# EAGLE design SpiderFab (EAGLE 9.5.1)
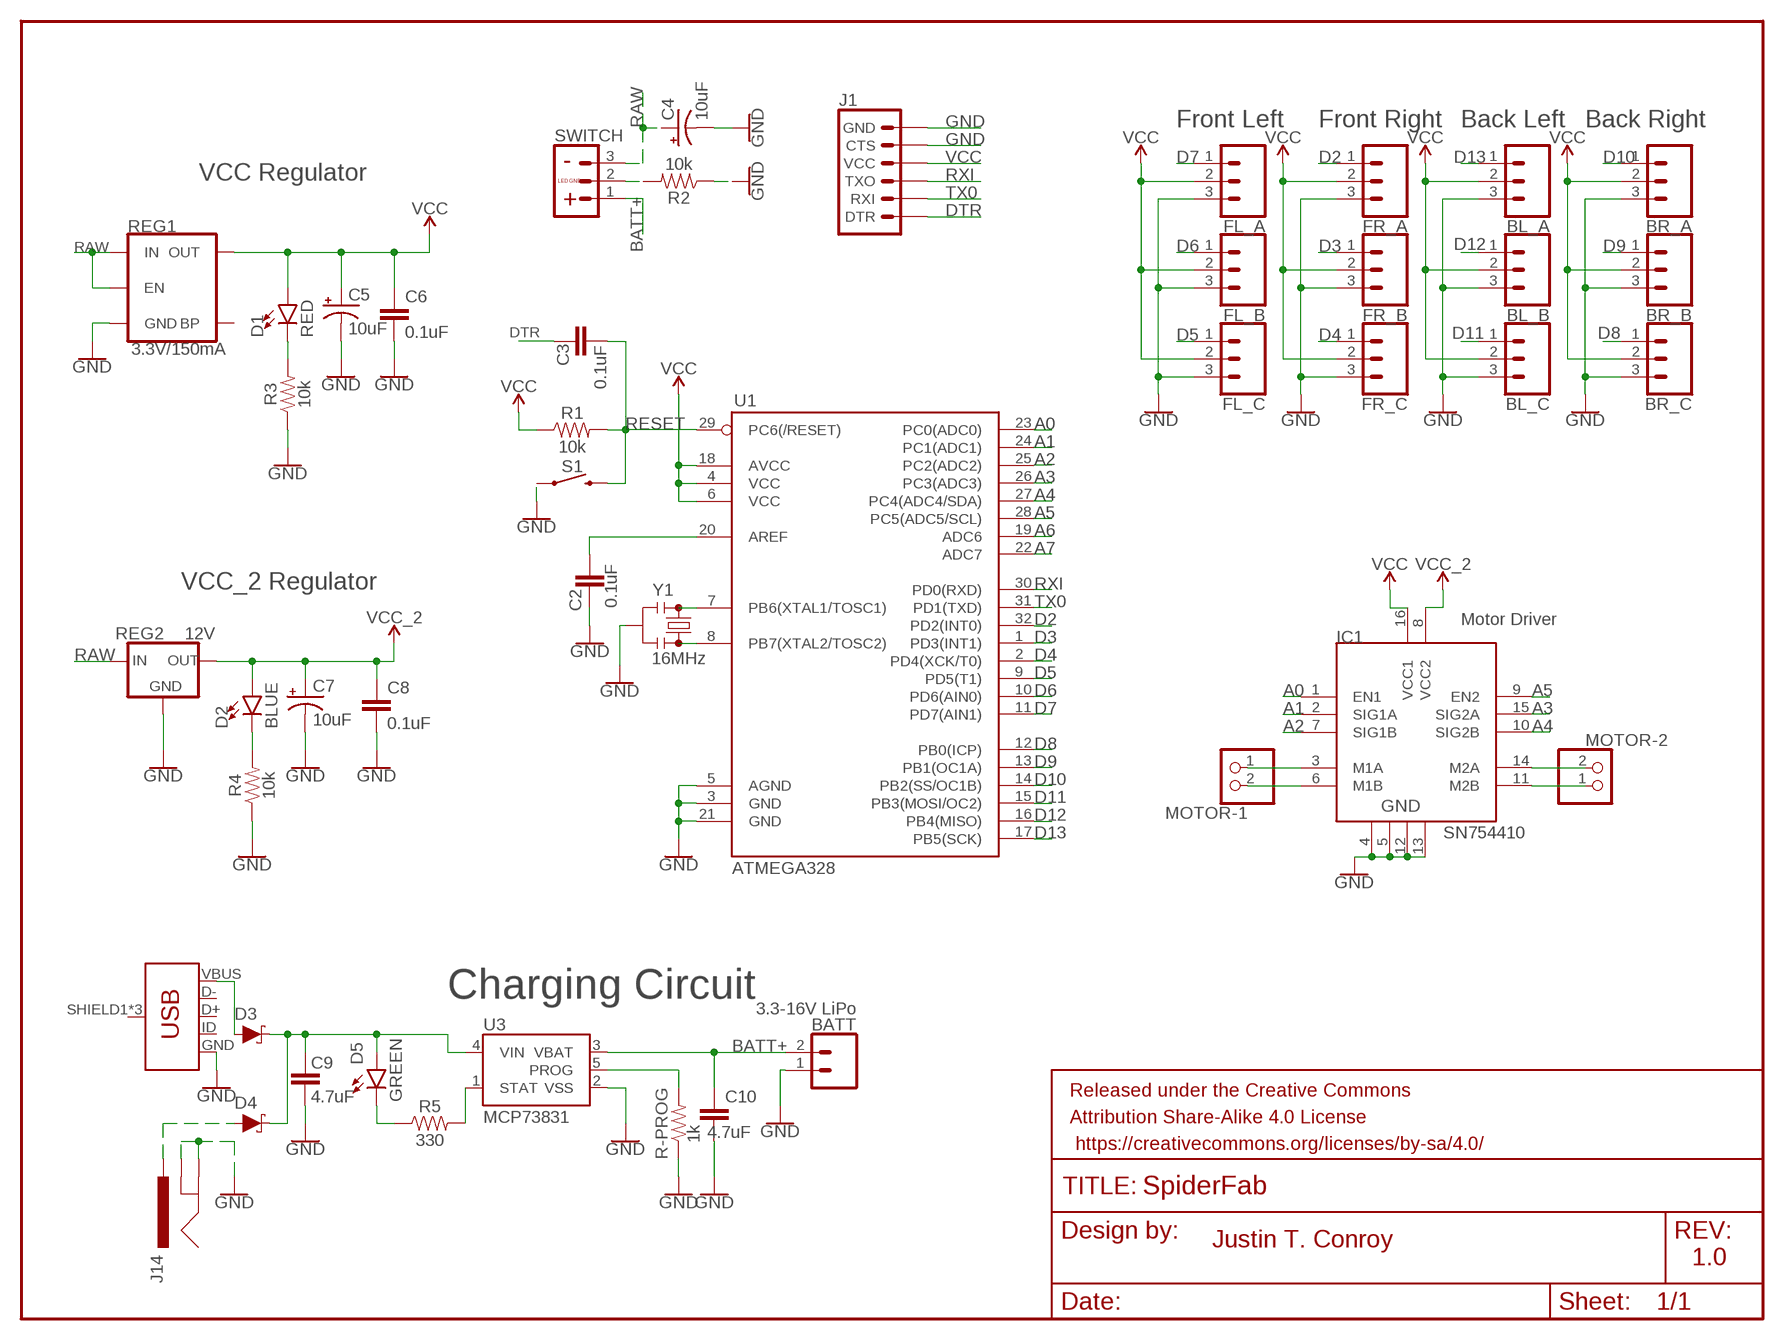
[diagram p0: schematic, sheet 1]

## Parts
BATT  3.3-16V LiPo  CONN_02JST-PTH-2  [JST-2-PTH]
BL_A  CONN_03  [1X03]
BL_B  CONN_03  [1X03]
BL_C  CONN_03  [1X03]
BR_A  CONN_03  [1X03]
BR_B  CONN_03  [1X03]
BR_C  CONN_03  [1X03]
C2  0.1uF  0.1UF-0402-16V-10%  [0402]
C3  0.1uF  0.1UF-0603-25V-(+80/-20%)  [0603]
C4  10uF  10UF-POLAR-0603-6.3V-20%(TANT)  [0603-POLAR]
C5  10uF  10UF-POLAR-0603-6.3V-20%(TANT)  [0603-POLAR]
C6  0.1uF  0.1UF-0603-25V-(+80/-20%)  [0603]
C7  10uF  10UF-POLAR-0603-6.3V-20%(TANT)  [0603-POLAR]
C8  0.1uF  0.1UF-0603-25V-(+80/-20%)  [0603]
C9  4.7uF  4.7UF0603  [0603]
C10  4.7uF  4.7UF0603  [0603]
D1  RED  LED1206  [LED-1206]
D2  BLUE  LED1206  [LED-1206]
D3  1A/40V/500mV  DIODE-SCHOTTKY-BAT20J  [SOD-323]
D4  1A/40V/500mV  DIODE-SCHOTTKY-SS14  [SMA-DIODE]
D5  GREEN  LED1206  [LED-1206]
FL_A  CONN_03  [1X03]
FL_B  CONN_03  [1X03]
FL_C  CONN_03  [1X03]
FR_A  CONN_03  [1X03]
FR_B  CONN_03  [1X03]
FR_C  CONN_03  [1X03]
FRAME1  FRAME-LETTERNO_PACKAGE  [DUMMY]
IC1  SN754410  [DIP16]
J1  6_PIN_SERIAL_TARGETSILK  [6_PIN_SERIAL_TARGET_SIDE_W_SILK]
J14  POWER_JACK  [POWER_JACK_PTH]
MOTOR-1  JST_2PIN-THM  [JST-PH-2-THM]
MOTOR-2  JST_2PIN-THM  [JST-PH-2-THM]
R1  10k  10KOHM-0603-1/10W-1%  [0603]
R2  10k  10KOHM-0603-1/10W-1%  [0603]
R3  10k  10KOHM-0603-1/10W-1%  [0603]
R4  10k  10KOHM-0603-1/10W-1%  [0603]
R5  330  330OHM-0603-1/10W-1%  [0603]
R-PROG  1k  1KOHM-0603-1/10W-1%  [0603]
REG1  3.3V/150mA  V_REG_MIC52053.3V  [SOT23-5]
REG2  12V  V_REG_78XX-TO-220  [TO-220-ALT]
S1  MOMENTARY-SWITCH-SPST-SMD-4.5MM  [TACTILE_SWITCH_SMD_4.5MM]
SWITCH  CONN_03JST-PTH-VERT  [JST-3-PTH-VERT]
U1  ATMEGA328  ATMEGA168  [TQFP32-08]
U3  MCP73831  [SOT23-5]
X1  AMP FCI 10103594-0001LF  USB_MICRO-B_FEMALE-SMT  [USB-B-MICRO-SMD]
Y1  16MHz  RESONATOR-16MHZSMD_3.2X1.3  [RESONATOR-SMD-3.2X1.3]

## Nets
A0: IC1.1(EN1) U1.23(PC0(ADC0))
A1: IC1.2(SIG1A) U1.24(PC1(ADC1))
A2: IC1.7(SIG1B) U1.25(PC2(ADC2))
A3: IC1.15(SIG2A) U1.26(PC3(ADC3))
A4: IC1.10(SIG2B) U1.27(PC4(ADC4/SDA))
A5: IC1.9(EN2) U1.28(PC5(ADC5/SCL))
A6: U1.19(ADC6)
A7: U1.22(ADC7)
BATT+: BATT.2 C10.1 SWITCH.1 U3.3(VBAT)
D2: FR_A.1 U1.32(PD2(INT0))
D3: FR_B.1 U1.1(PD3(INT1))
D4: FR_C.1 U1.2(PD4(XCK/T0))
D5: FL_C.1 U1.9(PD5(T1))
D6: FL_B.1 U1.10(PD6(AIN0))
D7: FL_A.1 U1.11(PD7(AIN1))
D8: BR_C.1 U1.12(PB0(ICP))
D9: BR_B.1 U1.13(PB1(OC1A))
D10: BR_A.1 U1.14(PB2(SS/OC1B))
D11: BL_C.1 U1.15(PB3(MOSI/OC2))
D12: BL_B.1 U1.16(PB4(MISO))
D13: BL_A.1 U1.17(PB5(SCK))
DTR: C3.1 J1.P$1(DTR)
GND: BATT.1 BL_A.3 BL_B.3 BL_C.3 BR_A.3 BR_B.3 BR_C.3 C2.2 C4.- C5.- C6.2 C7.- C8.2 C9.2 C10.2 FL_A.3 FL_B.3 FL_C.3 FR_A.3 FR_B.3 FR_C.3 IC1.4 IC1.5 IC1.12 IC1.13 J1.P$5(CTS) J1.P$6(GND) J14.GND J14.GNDBREAK R2.1 R3.1 R4.1 R-PROG.1 REG1.2(GND) REG2.GND S1.2 S1.3 U1.3(GND) U1.5(AGND) U1.21(GND) U3.2(VSS) X1.GND Y1.2
N$1: U1.7(PB6(XTAL1/TOSC1)) Y1.1
N$2: U1.8(PB7(XTAL2/TOSC2)) Y1.3
N$3: IC1.3(M1A) MOTOR-1.1
N$4: C2.1 U1.20(AREF)
N$5: IC1.6(M1B) MOTOR-1.2
N$6: IC1.14(M2A) MOTOR-2.2
N$7: IC1.11(M2B) MOTOR-2.1
N$8: D3.A X1.VBUS
N$9: D4.A J14.PWR
N$10: D2.C R4.2
N$11: R2.2 SWITCH.2
N$12: D1.C R3.2
N$14: C9.1 D3.C D4.C D5.A U3.4(VIN)
N$15: D5.C R5.1
N$16: R5.2 U3.1(STAT)
N$19: R-PROG.2 U3.5(PROG)
RAW: C4.+ REG1.1(IN) REG1.3(EN) REG2.IN SWITCH.3
RESET: C3.2 R1.2 S1.1 S1.4 U1.29(PC6(/RESET))
RXI: J1.P$2(TXO) U1.30(PD0(RXD))
TX0: J1.P$3(RXI) U1.31(PD1(TXD))
VCC: BL_A.2 BL_B.2 BL_C.2 BR_A.2 BR_B.2 BR_C.2 C5.+ C6.1 D1.A FL_A.2 FL_B.2 FL_C.2 FR_A.2 FR_B.2 FR_C.2 IC1.16(VCC1) J1.P$4(VCC) R1.1 REG1.5(OUT) U1.4(VCC) U1.6(VCC) U1.18(AVCC)
VCC_2: C7.+ C8.1 D2.A IC1.8(VCC2) REG2.OUT
Unconnected: REG1.4(BP) X1.D+ X1.D- X1.ID X1.SHIELD1(SHIELD) X1.SHIELD2(SHIELD) X1.SHIELD3(SHIELD)

## Notes on the sheet
- Front Left | Front Right | Back Left | Back Right
- -
- VCC Regulator
- LED GND
- +
- VCC_2 Regulator
- Motor Driver
- Charging Circuit
- Justin T. Conroy
- 1.0

## Library data of the parts
BATT = SparkFun-Connectors:CONN_02: Multi connection point. Often used as Generic Header-pin footprint for 0.1 inch spaced/style header connections On any of the 0.1 inch spaced packages, you can populate with these: Break Away Headers - Straight <https://www.sparkfun.com/products/116> (PRT-00116) Break Away Male Headers - Right Angle <https://www.sparkfun.com/products/553> (PRT-00553) Female Headers <https://www.sparkfun.com/products/115> (PRT-00115) Break Away Headers - Machine Pin <https://www.sparkfun.com/products/117> (PRT-00117) Break Away Female Headers - Swiss Machine Pin <https://www.sparkfun.com/products/743> (PRT-00743) For SCREWTERMINALS and SPRING TERMINALS visit here: Screw Terimnals on SparkFun.com <https://www.sparkfun.com/search/results?term=Screw+Terminals> (5mm/3.5mm/2.54mm spacing) This device is also useful as a general connection point to wire up your design to another part of your project. Our various solder wires solder well into these plated through hole pads. Hook-Up Wire - Assortment (Stranded, 22 AWG) <https://www.sparkfun.com/products/11375> (PRT-11375) Hook-Up Wire - Assortment (Solid Core, 22 AWG) <https://www.sparkfun.com/products/11367> (PRT-11367) View the entire wire category on our website here <https://www.sparkfun.com/categories/141> Special notes: Molex polarized connector foot print use with: PRT-08233 with associated crimp pins and housings. 2.54_SCREWTERM for use with PRT-10571. 3.5mm Screw Terminal footprints for PRT-08084 5mm Screw Terminal footprints for use with PRT-08432; PROD_ID: CONN-09863; SKU: PRT-09914
BL_A BL_B BL_C BR_A BR_B BR_C FL_A FL_B FL_C FR_A FR_B FR_C = SparkFun-Connectors:CONN_03: Multi connection point. Often used as Generic Header-pin footprint for 0.1 inch spaced/style header connections On any of the 0.1 inch spaced packages, you can populate with these: Break Away Headers - Straight <https://www.sparkfun.com/products/116> (PRT-00116) Break Away Male Headers - Right Angle <https://www.sparkfun.com/products/553> (PRT-00553) Female Headers <https://www.sparkfun.com/products/115> (PRT-00115) Break Away Headers - Machine Pin <https://www.sparkfun.com/products/117> (PRT-00117) Break Away Female Headers - Swiss Machine Pin <https://www.sparkfun.com/products/743> (PRT-00743) Stackable Header - 3 Pin (Female, 0.1") <https://www.sparkfun.com/products/13875> (PRT-13875) For SCREWTERMINALS and SPRING TERMINALS visit here: Screw Terimnals on SparkFun.com <https://www.sparkfun.com/search/results?term=Screw+Terminals> (5mm/3.5mm/2.54mm spacing) This device is also useful as a general connection point to wire up your design to another part of your project. Our various solder wires solder well into these plated through hole pads. Hook-Up Wire - Assortment (Stranded, 22 AWG) <https://www.sparkfun.com/products/11375> (PRT-11375) Hook-Up Wire - Assortment (Solid Core, 22 AWG) <https://www.sparkfun.com/products/11367> (PRT-11367) View the entire wire category on our website here <https://www.sparkfun.com/categories/141> Special notes: Molex polarized connector foot print use with SKU : PRT-08232 with associated crimp pins and housings.
C2 = SparkFun-Capacitors:0.1UF: 0.1µF ceramic capacitors A capacitor is a passive two-terminal electrical component used to store electrical energy temporarily in an electric field.; PROD_ID: CAP-12416
C3 C6 C8 = SparkFun-Capacitors:0.1UF: 0.1µF ceramic capacitors A capacitor is a passive two-terminal electrical component used to store electrical energy temporarily in an electric field.; PROD_ID: CAP-00810
C4 C5 C7 = SparkFun-Capacitors:10UF-POLAR: 10.0µF polarized capacitors A capacitor is a passive two-terminal electrical component used to store electrical energy temporarily in an electric field.; PROD_ID: CAP-13210
C9 C10 = SparkFun-Capacitors:4.7UF: 4.7µF ceramic capacitors A capacitor is a passive two-terminal electrical component used to store electrical energy temporarily in an electric field.; PROD_ID: CAP-08280
D1 D2 D5 = SparkFun-LED:LED: LED (Generic) Standard schematic elements and footprints for 5mm, 3mm, 1206, and 0603 sized LEDs. Generic LEDs with no color specified.
D3 = SparkFun-DiscreteSemi:DIODE-SCHOTTKY: Schottky diode A Schottky diode is a semiconductor diode which has a low forward voltage drop and a very fast switching action.; PROD_ID: DIO-11623; VALUE: 1A/23V/620mV
D4 = SparkFun-DiscreteSemi:DIODE-SCHOTTKY: Schottky diode A Schottky diode is a semiconductor diode which has a low forward voltage drop and a very fast switching action.; PROD_ID: DIO-08053
FRAME1 = SparkFun-Aesthetics:FRAME-LETTER: Schematic Frame - Letter Standard 8.5x11 US Letter frame; DESIGNER: Justin T. Conroy; VERSION: v01
IC1 = HBridge:SN754410: Quadruple half-H driver
J1 = SparkFun-Connectors:6_PIN_SERIAL_TARGET: 6-pin header connection for use with the "FTDI BASIC" pinout - TARGET SIDE. Also known as "Arduino Serial Program Header". It is used to mate with our FTDI Basic serial programmers using the Arduino IDE. Note, this device has "TARGET" in the name. It is intended to be used on a design that contains a target micro-controller that you wish to program. The "sister" device, named "CABLE" is inteneded to be used on a design that usually lives on the end of your USB cable and prvides the converter chip (FTDI232 or FTDI231x) to commnicate serial RX/TX. You can populate with some of these: Break Away Headers - Straight <https://www.sparkfun.com/products/116> (PRT-00116) For reference (or to suit your programming needs) check out these designs: SparkFun FTDI Basic Breakout - 5V <https://www.sparkfun.com/products/9716> (DEV-09716) SparkFun FTDI Basic Breakout - 3.3V <https://www.sparkfun.com/products/9873> (DEV-09873) SparkFun FTDI SmartBasic <https://www.sparkfun.com/products/12935> (DEV-12935) SparkFun Beefy 3 - FTDI Basic Breakout <https://www.sparkfun.com/products/13746> (DEV-13746)
J14 = SparkFun-Connectors:POWER_JACK: Power Jack Connector This is the standard 5.5mm barrel jack for power. The PTH is the most common, proven, reliable, footprint. The Slot footprint only works if the mill layer is transmitted to the PCB fab house so be warned. Here are the connectors we sell at SparkFun: DC Barrel Power Jack/Connector <https://www.sparkfun.com/products/119> (PRT-00119) DC Barrel Power Jack/Connector (SMD) <https://www.sparkfun.com/products/12748> (PRT-12748) DC Barrel Jack Adapter - Breadboard Compatible <https://www.sparkfun.com/products/10811> (PRT-10811) It is used on this SparkFun product (and many, many others): SparkFun RedBoard - Programmed with Arduino <https://www.sparkfun.com/products/12757> (DEV-12757) Also, if you need a mating power supply or connector, please check these out: Wall Adapter Power Supply - 9VDC 650mA <https://www.sparkfun.com/products/298> (TOL-00298) DC Barrel Jack Adapter - Male <https://www.sparkfun.com/products/10287> (PRT-10287); PROD_ID: CONN-08197
MOTOR-1 MOTOR-2 = adafruit:JST_2PIN: JST 2-Pin Connectors of various flavors SMT-RA (S2B-PH-SM4) 4UConnector #17311 SMT (B2B-PH-SM4) THM-RA (S2B-PH) THM (B2B-PH)
R1-R4 = SparkFun-Resistors:10KOHM: 10kΩ resistor A resistor is a passive two-terminal electrical component that implements electrical resistance as a circuit element. Resistors act to reduce current flow, and, at the same time, act to lower voltage levels within circuits. - Wikipedia; PROD_ID: RES-00824
R5 = SparkFun-Resistors:330OHM: 330Ω resistor A resistor is a passive two-terminal electrical component that implements electrical resistance as a circuit element. Resistors act to reduce current flow, and, at the same time, act to lower voltage levels within circuits. - Wikipedia; PROD_ID: RES-00818
R-PROG = SparkFun-Resistors:1KOHM: 1kΩ resistor A resistor is a passive two-terminal electrical component that implements electrical resistance as a circuit element. Resistors act to reduce current flow, and, at the same time, act to lower voltage levels within circuits. - Wikipedia; PROD_ID: RES-07856
REG1 = SparkFun-IC-Power:V_REG_MIC5205: V_REG MIC5205 Standard 3.3V, 5V, and Adjustable 150mA LDO voltage regulator in SOT-23 layout. Micrel part MIC5205. BP (by-pass) pin is used to lower output noise with 470pF cap, may be left open. On the adjustable version BP is used to set output.; PROD_ID: VREG-00822
REG2 = SparkFun-IC-Power:V_REG_78XX: Voltage Regulator Standard 78xx regulator. IGO (Input Ground Output). Spark Fun Electronics SKU : COM-00107; PROD_ID: VREG-08450; SF_ID: COM-00107
S1 = SparkFun-Switches:MOMENTARY-SWITCH-SPST: Momentary Switch (Pushbutton) - SPST Normally-open (NO) SPST momentary switches (buttons, pushbuttons). Variants PTH-12MM - 12mm square, through-hole Momentary Pushbutton Switch - 12mm Square <https://www.sparkfun.com/products/9190> (COM-09190) PTH-6.0MM, PTH-6.0MM-KIT - 6.0mm square, through-hole Mini Pushbutton Switch <https://www.sparkfun.com/products/97> (COM-00097) KIT package intended for soldering kit's - only one side of pads' copper is exposed. PTH-RIGHT-ANGLE-KIT - Right-angle, through-hole Right Angle Tactile Button <https://www.sparkfun.com/products/10791> - Used on SparkFun BigTime Watch Kit <https://www.sparkfun.com/products/11734> SMD-12MM - 12mm square, surface-mount Tactile Button - SMD (12mm) <https://www.sparkfun.com/products/12993> (COM-12993) Used on SparkFun PicoBoard <https://www.sparkfun.com/products/11888> SMD-4.5MM - 4.5mm Square Trackball Switch Used on SparkFun Blackberry Trackballer Breakout <https://www.sparkfun.com/products/13169> SMD-4.6MMX2.8MM - 4.60mm x 2.80mm, surface mount Used on SparkFun SAMD21 Mini Breakout <https://www.sparkfun.com/products/13664> SMD-5.2MM, SMD-5.2-REDUNDANT - 5.2mm square, surface-mount Mini Pushbutton Switch - SMD <https://www.sparkfun.com/products/8720> (COM-08720) Used on Arduino Pro Mini <https://www.sparkfun.com/products/11114> REDUNDANT package connects both switch circuits together SMD-6.0X3.5MM - 6.0 x 3.5mm, surface mount Momentary Reset Switch SMD <https://www.sparkfun.com/products/8229> (COM-08229) SMD-6.2MM-TALL - 6.2mm square, surface mount Tactile Button - SMD (6mm) <https://www.sparkfun.com/products/12992> Used on SparkFun Digital Sandbox <https://www.sparkfun.com/products/12651> SMD-RIGHT-ANGLE - Right-angle, surface mount Used on SparkFun Block for Intel® Edison - Arduino <https://www.sparkfun.com/products/13036>; PROD_ID: SWCH-09213
SWITCH = SparkFun-Connectors:CONN_03: Multi connection point. Often used as Generic Header-pin footprint for 0.1 inch spaced/style header connections On any of the 0.1 inch spaced packages, you can populate with these: Break Away Headers - Straight <https://www.sparkfun.com/products/116> (PRT-00116) Break Away Male Headers - Right Angle <https://www.sparkfun.com/products/553> (PRT-00553) Female Headers <https://www.sparkfun.com/products/115> (PRT-00115) Break Away Headers - Machine Pin <https://www.sparkfun.com/products/117> (PRT-00117) Break Away Female Headers - Swiss Machine Pin <https://www.sparkfun.com/products/743> (PRT-00743) Stackable Header - 3 Pin (Female, 0.1") <https://www.sparkfun.com/products/13875> (PRT-13875) For SCREWTERMINALS and SPRING TERMINALS visit here: Screw Terimnals on SparkFun.com <https://www.sparkfun.com/search/results?term=Screw+Terminals> (5mm/3.5mm/2.54mm spacing) This device is also useful as a general connection point to wire up your design to another part of your project. Our various solder wires solder well into these plated through hole pads. Hook-Up Wire - Assortment (Stranded, 22 AWG) <https://www.sparkfun.com/products/11375> (PRT-11375) Hook-Up Wire - Assortment (Solid Core, 22 AWG) <https://www.sparkfun.com/products/11367> (PRT-11367) View the entire wire category on our website here <https://www.sparkfun.com/categories/141> Special notes: Molex polarized connector foot print use with SKU : PRT-08232 with associated crimp pins and housings.; PROD_ID: CONN-13230
U1 = SparkFun:ATMEGA168
U3 = SparkFun-PowerIC:MCP73831: Miniature single cell, fully integrated Li-Ion, Li-polymer charge management controller http://ww1.microchip.com/downloads/en/DeviceDoc/21984a.pdf IC-09995; PROD_ID: IC-09995
X1 = SparkFun-Connectors:USB_MICRO-B: USB Type Micro-B Connector Male/female and PTH/SMT variants SparkFun Products: SparkFun microB USB Breakout <https://www.sparkfun.com/products/12035> SparkFun USB microB Plug Breakout <https://www.sparkfun.com/products/10031> SparkFun ESP8266 Thing <https://www.sparkfun.com/products/13231>; PROD_ID: CONN-11752
Y1 = SparkFun-Clocks:RESONATOR-16MHZ: 16MHz Resonator Digikey Example <http://www.digikey.com/product-detail/en/murata-electronics-north-america/CSTCE16M0V53-R0/490-1198-1-ND/584635> Frequency: 16MHz Frequency Stability: ±0.3% Frequency Tolerance: ±0.5% Capacitance: 15pF SparkFun Products SparkFun OpenLog <https://www.sparkfun.com/products/13712> SparkFun MicroView - OLED Arduino Module <https://www.sparkfun.com/products/12923>; PROD_ID: XTAL-08900

## Board
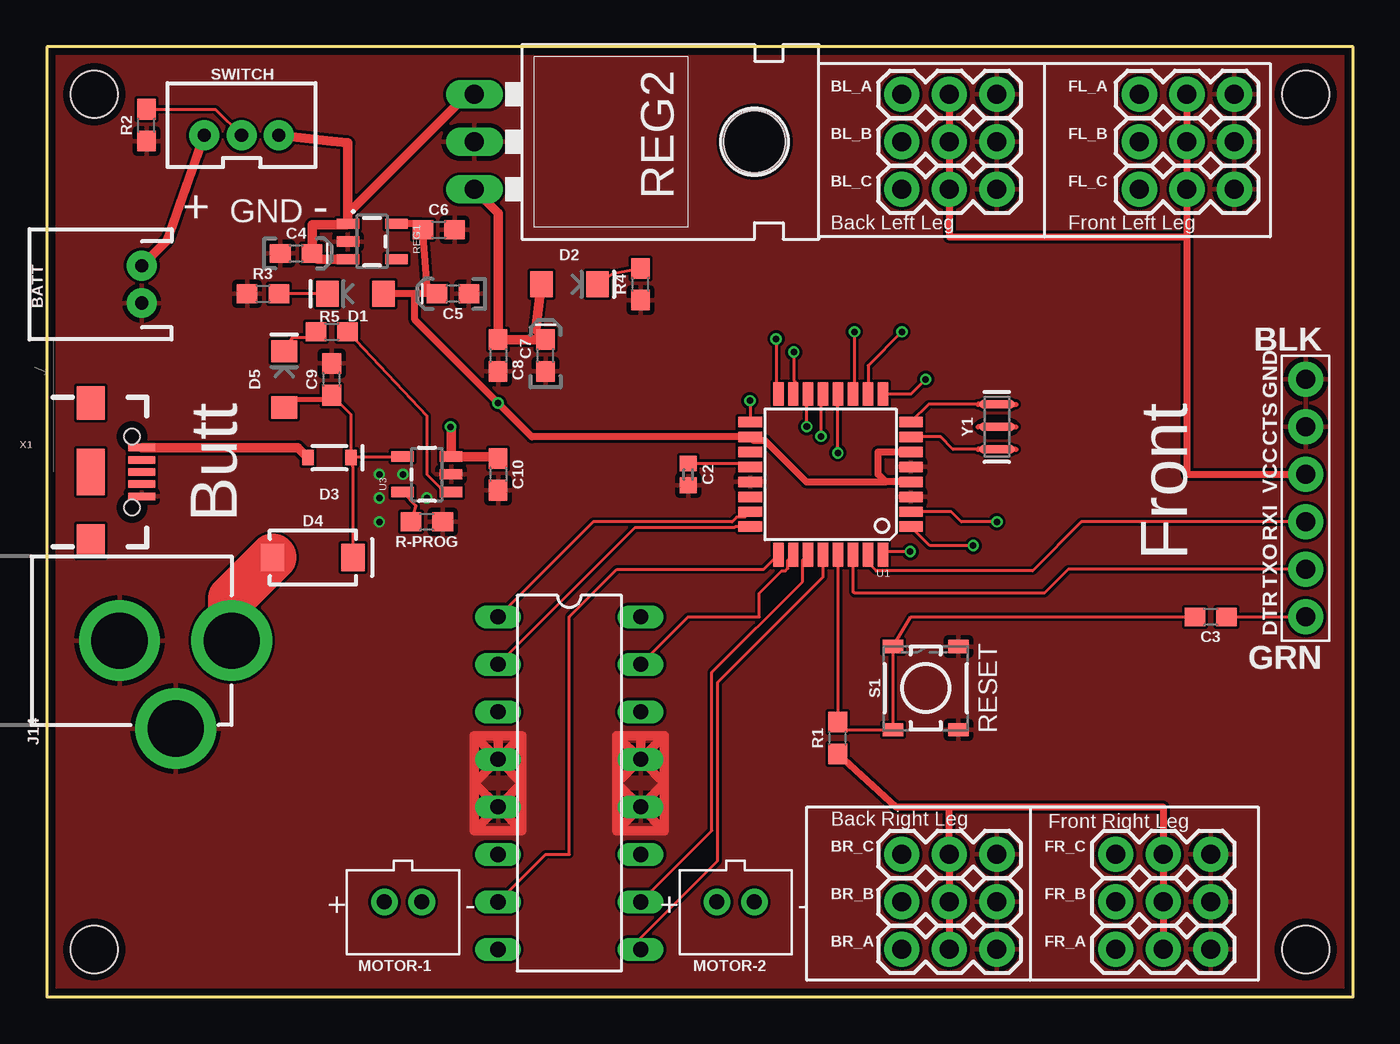
[diagram p1: board, top side]
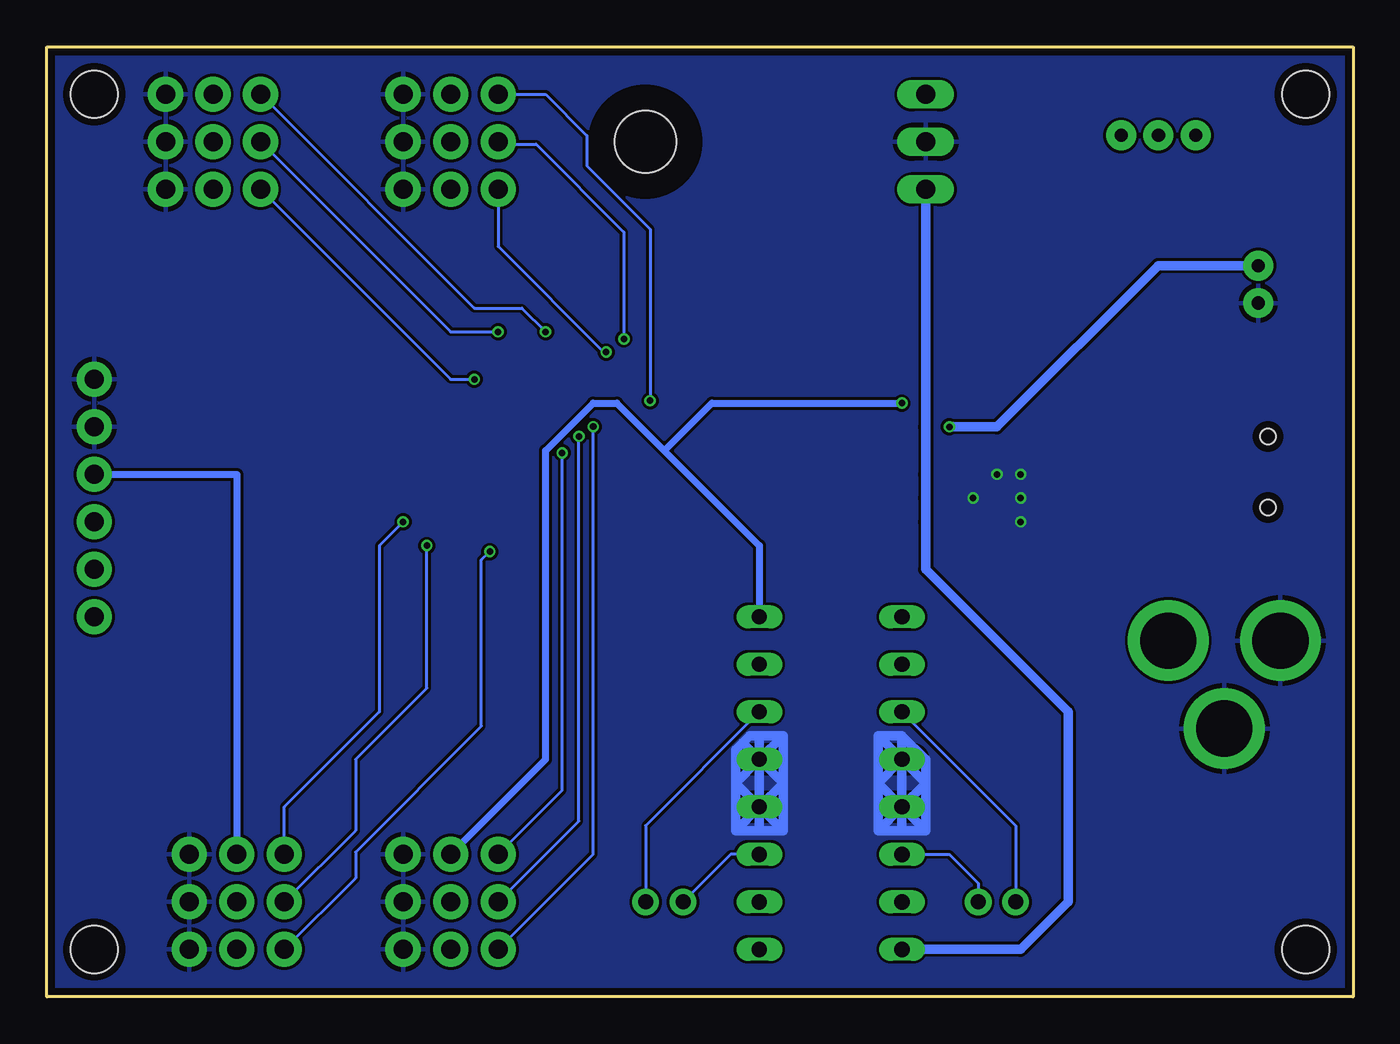
[diagram p2: board, bottom side, seen from below]

Size 69.85 x 50.8 mm. Coordinates in mm from the lower left corner, seen from the top.
Outline: 0,0 69.85,0 69.85,50.8 0,50.8 0,0
Copper layers (1*16): Top 0.035559375mm / dielectric 1.6mm / Bottom 0.035559375mm
Design rules "oshpark-2layer": minimum track width 6mil, minimum drill 10mil, track to track 6mil, track to pad 6mil, pad to pad 6mil, via to via 6mil, smd to smd 6mil, copper to edge 15mil, drill to drill 6mil, minimum pad ring 5mil, minimum via ring 5mil, stop-mask expansion 2.5mil, vias tented up to drill 0mil, thermal gap 10mil
Holes 2.54 mm at 67.31,2.54 67.31,48.26 2.54,48.26 2.54,2.54

### Footprints (pad centres in the part's own frame; a part is rotated, then mirrored left to right if it is on the bottom)
JST-2-PTH = drill 0.7 pad 1.6: 1 -1,0; 2 1,0
1X03 = drill 1.016 pad 1.88: 1 0,0; 2 2.54,0; 3 5.08,0
0402 = smd 0.85 x 0.9: 1 -0.58,0; 2 0.58,0
0603 = smd 1.1 x 1: 1 -0.85,0; 2 0.85,0
0603-POLAR = smd 1.1 x 1: + 0.85,0; - -0.85,0
LED-1206 = smd 1.2 x 1.4: A -1.5,0; C 1.5,0
SOD-323 = smd 0.63 x 0.83: A 1.15,0; C -1.15,0
SMA-DIODE = smd 1.27 x 1.47: A -2.15,0; C 2.15,0
DIP16 = drill 0.813 long: 1 -10.16,-3.81; 2 -7.62,-3.81; 3 -5.08,-3.81; 4 -2.54,-3.81; 5 0,-3.81; 6 2.54,-3.81; 7 5.08,-3.81; 8 7.62,-3.81; 9 7.62,3.81; 10 5.08,3.81; 11 2.54,3.81; 12 0,3.81; 13 -2.54,3.81; 14 -5.08,3.81; 15 -7.62,3.81; 16 -10.16,3.81
6_PIN_SERIAL_TARGET_SIDE_W_SILK = drill 1.016 pad 1.88: P$1 -6.35,0; P$2 -3.81,0; P$3 -1.27,0; P$4 1.27,0; P$5 3.81,0; P$6 6.35,0
POWER_JACK_PTH = drill 2.997 pad 4.318: GND 0,7.7; GNDBREAK 4.7,10.7; PWR 0,13.7
JST-PH-2-THM = drill 0.8 pad 1.422: 1 1,0; 2 -1,0
SOT23-5 = smd 0.55 x 1.2: 1 -0.95,-1.3; 2 0,-1.3; 3 0.95,-1.3; 4 0.95,1.3; 5 -0.95,1.3
TO-220-ALT = drill 1.016 long: GND 0,-3.81; IN -2.54,-3.81; OUT 2.54,-3.81 | hole 3.302: 0,11.176
TACTILE_SWITCH_SMD_4.5MM = smd 0.7 x 1.1: 1 2.225,1.75; 2 2.225,-1.75; 3 -2.225,-1.75; 4 -2.225,1.75
JST-3-PTH-VERT = drill 0.7 pad 1.6: 1 -2,-0.55; 2 0,-0.55; 3 2,-0.55
TQFP32-08 = smd 1.27 x 0.559: 1 -4.293,2.8; 2 -4.293,2; 3 -4.293,1.2; 4 -4.293,0.4; 5 -4.293,-0.4; 6 -4.293,-1.2; 7 -4.293,-2; 8 -4.293,-2.8; 17 4.293,-2.8; 18 4.293,-2; 19 4.293,-1.2; 20 4.293,-0.4; 21 4.293,0.4; 22 4.293,1.2; 23 4.293,2; 24 4.293,2.8 | smd 0.559 x 1.27: 9 -2.8,-4.293; 10 -2,-4.293; 11 -1.2,-4.293; 12 -0.4,-4.293; 13 0.4,-4.293; 14 1.2,-4.293; 15 2,-4.293; 16 2.8,-4.293; 25 2.8,4.293; 26 2,4.293; 27 1.2,4.293; 28 0.4,4.293; 29 -0.4,4.293; 30 -1.2,4.293; 31 -2,4.293; 32 -2.8,4.293
USB-B-MICRO-SMD = smd 1.45 x 0.4: D+ 2.725,0; D- 2.725,0.65; GND 2.725,-1.3; ID 2.725,-0.65; VBUS 2.725,1.3 | smd 1.5 x 1.8: SHIELD1 0,3.685; SHIELD2 0,-3.685 | smd 1.5 x 2.5: SHIELD3 0,0 | hole 0.85: 2.2,1.9; 2.2,-1.9
RESONATOR-SMD-3.2X1.3 = smd 0.45 x 1.905: 1 -1.2,0; 2 0,0; 3 1.2,0

### Placement (x,y rotation side)
BATT  5.08,38.1 90 top
BL_A  45.72,48.26 0 top
BL_B  45.72,45.72 0 top
BL_C  45.72,43.18 0 top
BR_A  45.72,2.54 0 top
BR_B  45.72,5.08 0 top
BR_C  45.72,7.62 0 top
C2  34.29,27.94 270 top
C3  62.23,20.32 180 top
C4  13.34,39.75 0 top
C5  21.72,37.59 180 top
C6  20.95,41.02 0 top
C7  26.67,34.29 90 top
C8  24.13,34.29 270 top
C9  15.24,33.02 90 top
C10  24.13,27.94 270 top
D1  16.51,37.59 180 top
D2  27.94,38.1 0 top
D3  15.11,28.83 180 top
D4  14.22,23.5 0 top
D5  12.7,33.02 90 top
FL_A  58.42,48.26 0 top
FL_B  58.42,45.72 0 top
FL_C  58.42,43.18 0 top
FR_A  57.15,2.54 0 top
FR_B  57.15,5.08 0 top
FR_C  57.15,7.62 0 top
FRAME1  0,0 0 top
IC1  27.94,10.16 270 top
J1  67.31,26.67 90 top
J14  -3.81,19.05 270 top
MOTOR-1  19.05,5.08 180 top
MOTOR-2  36.83,5.08 180 top
R1  42.29,13.84 90 top
R2  5.33,46.61 90 top
R3  11.56,37.59 0 top
R4  31.75,38.1 90 top
R5  15.24,35.56 0 top
R-PROG  20.32,25.4 180 top
REG1  17.4,40.39 270 top
REG2  26.67,45.72 270 top
S1  46.99,16.51 90 top
SWITCH  10.41,46.61 0 top
U1  41.91,27.94 180 top
U3  20.32,27.94 90 top
X1  2.35,28.07 0 top
Y1  50.8,30.48 90 top

### Tracks (layer width: path | path; a pad name or v marks a point on that pad's centre or on a via)
A0
  Top 0.152: U1.23 37.33,25.65 36.89,25.65 36.64,25.4 29.21,25.4 IC1.1
A1
  Top 0.152: U1.24 36.81,25.14 36.77,25.09 31.45,25.09 IC1.2
A2
  Top 0.152: IC1.7 26.67,7.62 27.94,7.62 27.94,20.32 30.48,22.86 38.32,22.86 U1.25
A3
  Top 0.152: IC1.15 34.29,20.32 38.1,20.32 38.1,21.59 39.29,22.78 39.48,22.78 39.62,22.92 39.62,23.36 U1.26
A4
  Top 0.152: IC1.10 35.56,8.89 35.56,17.35 40.42,22.21 40.42,23.36 U1.27
A5
  Top 0.152: IC1.9 31.75,3.16 35.87,7.28 35.87,16.82 41.51,22.46 U1.28
BATT+  (via drill 0.35)
  Top 0.508: C10.1 24.03,28.89 U3.3 21.62,30.45 v21.59,30.48 | BATT.2 6.43,40.45 SWITCH.1
  Bottom 0.508: BATT.2 10.43,39.1 19.05,30.48 v21.59,30.48
D2  (via drill 0.35)
  Top 0.152: v46.16,23.81 44.88,23.81 U1.32
  Bottom 0.152: FR_A.1 53.34,6.35 53.34,7.75 46.61,14.48 46.61,23.37 v46.16,23.81
D3  (via drill 0.35)
  Top 0.152: v49.53,24.13 47.21,24.13 U1.1
  Bottom 0.152: FR_B.1 53.34,8.89 53.34,12.7 49.53,16.51 v49.53,24.13
D4  (via drill 0.35)
  Top 0.152: v50.8,25.4 48.9,25.4 48.35,25.94 U1.2
  Bottom 0.152: FR_C.1 57.15,10.16 52.07,15.24 52.07,24.13 v50.8,25.4
D5  (via drill 0.35)
  Top 0.152: v46.99,33.02 46.2,32.23 U1.9
  Bottom 0.152: FL_C.1 48.26,33.02 v46.99,33.02
D6  (via drill 0.35)
  Top 0.152: v45.72,35.56 43.91,33.75 U1.10
  Bottom 0.152: FL_B.1 48.26,35.56 v45.72,35.56
D7  (via drill 0.35)
  Top 0.152: v43.18,35.56 43.18,32.3 U1.11
  Bottom 0.152: FL_A.1 46.99,36.83 44.45,36.83 v43.18,35.56
D8  (via drill 0.35)
  Top 0.152: v42.29,29.08 42.29,32.21 U1.12
  Bottom 0.152: BR_C.1 42.29,11.05 v42.29,29.08
D9  (via drill 0.35)
  Top 0.152: v41.4,29.97 41.4,32.12 U1.13
  Bottom 0.152: BR_B.1 41.4,9.4 v41.4,29.97
D10  (via drill 0.35)
  Top 0.152: v40.63,30.49 40.63,32.16 U1.14
  Bottom 0.152: BR_A.1 40.64,7.62 v40.64,30.48 v40.63,30.49
D11  (via drill 0.35)
  Top 0.152: v39.94,34.48 39.94,32.96 40.01,32.89 40.01,32.33 U1.15
  Bottom 0.152: BL_C.1 45.72,40.13 40.01,34.42 v39.94,34.48
D12  (via drill 0.35)
  Top 0.152: v38.99,35.18 38.99,32.35 U1.16
  Bottom 0.152: BL_B.1 45.59,45.59 43.69,45.59 38.99,40.89 v38.99,35.18
D13  (via drill 0.35)
  Top 0.152: v37.59,31.88 37.62,31.85 U1.17
  Bottom 0.152: BL_A.1 43.18,48.26 40.97,46.05 40.97,44.43 37.59,41.05 v37.59,31.88
DTR
  Top 0.152: C3.1 J1.P$1
GND  (via drill 0.35)
  Top 0.508: IC1.13 31.75,13.97 | 31.75,13.97 30.48,13.97 | 30.48,8.89 33.02,8.89 | 33.02,13.97 33.02,11.43 | 33.02,11.43 33.02,8.89 | 30.48,13.97 30.48,11.43 | 30.48,11.43 30.48,8.89 | 24.13,13.97 25.4,13.97 | 25.4,8.89 25.4,11.43 | 25.4,11.43 25.4,13.97 | 25.4,8.89 22.86,8.89 | 22.86,8.89 22.86,11.43 | 22.86,11.43 22.86,13.97 | 22.86,13.97 24.13,13.97 | 24.13,13.97 IC1.4 | 33.02,13.97 31.75,13.97 | 33.02,13.97 IC1.13 | 22.86,13.97 IC1.4 | 25.4,13.97 IC1.4 | 25.4,8.89 IC1.5 | 22.86,8.89 IC1.5 | IC1.5 25.4,11.43 | IC1.5 22.86,11.43 | IC1.4 25.4,11.43 | IC1.4 22.86,11.43 | 30.48,13.97 IC1.13 | 30.48,8.89 IC1.12 | 33.02,8.89 IC1.12 | IC1.12 33.02,11.43 | IC1.12 30.48,11.43 | IC1.13 33.02,11.43 | IC1.13 30.48,11.43
  Bottom 0.508: IC1.13 31.75,13.97 | 31.75,13.97 30.48,13.97 | 30.48,13.97 30.48,11.43 | 30.48,11.43 30.48,8.89 | 30.48,8.89 31.75,8.89 | 33.02,8.89 31.75,8.89 | 33.02,11.43 33.02,13.22 32.64,13.59 | 33.02,11.43 33.02,8.89 | 32.64,13.59 32.27,13.97 31.75,13.97 | IC1.12 IC1.13 | 31.75,8.89 IC1.12 | IC1.13 30.48,13.97 | IC1.13 32.64,13.59 | IC1.13 33.02,11.43 | IC1.13 30.48,11.43 | IC1.12 33.02,8.89 | IC1.12 30.48,8.89 | IC1.12 33.02,11.43 | IC1.12 30.48,11.43 | IC1.4 IC1.5 | 24.13,8.89 25.4,8.89 | 25.4,8.89 25.4,11.43 | 25.4,11.43 25.4,13.97 | 25.4,13.97 24.13,13.97 | 24.13,13.97 22.86,12.7 22.86,11.43 | 22.86,11.43 22.86,8.89 | 22.86,8.89 24.13,8.89 | 24.13,8.89 IC1.5 | IC1.4 24.13,13.97 | IC1.4 25.4,13.97 | IC1.4 25.4,11.43 | IC1.4 22.86,11.43 | IC1.5 25.4,11.43 | IC1.5 22.86,11.43 | IC1.5 22.86,8.89 | IC1.5 25.4,8.89
  other vias: 17.78,27.94 20.32,26.67 17.78,26.67 19.05,27.94 17.78,25.4
  pour Top: 0,50.8 0,0 69.85,0 69.85,50.8
  pour Bottom: 0,50.8 0,0 69.85,0 69.85,50.8
N$1
  Top 0.152: Y1.1 48.44,29.28 47.78,29.94 U1.7
N$2
  Top 0.152: Y1.3 47.14,31.68 U1.8
N$3
  Bottom 0.152: IC1.3 18.05,9.16 MOTOR-1.1
N$4
  Top 0.152: C2.1 37.44,28.52 U1.20
N$5
  Bottom 0.152: IC1.6 21.59,7.62 20.05,6.08 MOTOR-1.2
N$6
  Bottom 0.152: IC1.14 37.83,9.16 MOTOR-2.2
N$7
  Bottom 0.152: IC1.11 33.29,7.62 MOTOR-2.1
N$8
  Top 0.508: X1.VBUS 13.43,29.36 D3.A
N$9
  Top 2.54: J14.PWR 9.89,21.31 D4.A
N$10
  Top 0.152: D2.C 30.32,38.68 R4.2
N$11
  Top 0.152: R2.2 9.01,47.46 SWITCH.2
N$12
  Top 0.152: D1.C R3.2
N$14
  Top 0.152: D4.C 16.37,28.31 D3.C | D3.C 16.41,28.89 U3.4 | C9.1 15.45,31.96 16.26,31.15 D3.C
  Top 0.254: D5.A 13.14,31.96 15.45,31.96
N$15
  Top 0.152: R5.1 14.36,35.26 13.14,35.26 D5.C
N$16
  Top 0.152: R5.2 20.32,31.06 20.32,27.94 21.27,26.99 U3.1
N$19
  Top 0.152: U3.5 19.74,26.27 R-PROG.2
RAW
  Top 0.152: REG1.1 16.1,41.88
  Top 0.508: 16.1,41.88 22.48,48.26 REG2.IN | SWITCH.3 15.24,45.75 16.1,45.66 REG1.1 16.04,41.27 14.19,41.27 C4.+ 14.5,39.44 REG1.3
RESET
  Top 0.152: U1.29 42.31,14.81 R1.2 42.43,14.29 S1.4 S1.1 46.2,20.32 C3.2
RXI
  Top 0.152: J1.P$2 54.61,22.86 53.34,21.59 43.18,21.59 43.11,21.66 U1.30
TX0
  Top 0.152: J1.P$3 55.32,25.4 52.7,22.78 44.34,22.78 43.91,23.21 U1.31
VCC  (via drill 0.35)
  Top 0.152: 60.96,40.64 FL_C.2
  Top 0.381: BL_A.2 BL_B.2 BL_C.2 48.26,40.64 60.96,40.64 | FL_A.2 FL_B.2 FL_C.2 60.96,27.94 J1.P$4 | FR_A.2 FR_B.2 FR_C.2 59.69,10.16 48.26,10.16 | BR_A.2 BR_B.2 BR_C.2 48.26,10.16 | U1.6 44.45,29.14 44.45,27.94 44.85,27.54 | U1.4 44.85,27.54 | R1.1 45.39,10.16 48.26,10.16 | 20.38,37.59 C6.1 20.06,41.34 REG1.5 | 20.38,37.59 19.74,37.59 | 19.74,37.59 D1.A | 20.38,37.59 C5.+ | 19.74,37.59 19.68,37.54 19.68,36.2 v24.13,31.75 25.94,29.94 U1.18 37.8,29.76 38.39,29.76 40.62,27.54 44.85,27.54
  Bottom 0.381: BR_C.2 43.18,12.7 43.18,29.21 40.64,31.75 39.37,31.75 36.83,29.21 | 36.83,29.21 31.75,24.13 IC1.16 | 36.83,29.21 34.29,31.75 v24.13,31.75 | J1.P$4 59.69,27.94 FR_C.2
VCC_2
  Top 0.508: REG2.OUT 24.13,41.91 C8.1 24.4,35.14 C7.+ 26.14,35.67 D2.A
  Bottom 0.508: IC1.8 17.78,2.54 15.24,5.08 15.24,15.24 22.86,22.86 22.86,25.4 22.86,26.67 22.86,27.94 22.86,30.48 REG2.OUT

### Text on the board
tPlace: + | GND | - | Back Left Leg | Front Left Leg | Front | Butt | RESET | Back Right Leg | Front Right Leg